# Altium project Diplomski.PrjPcb
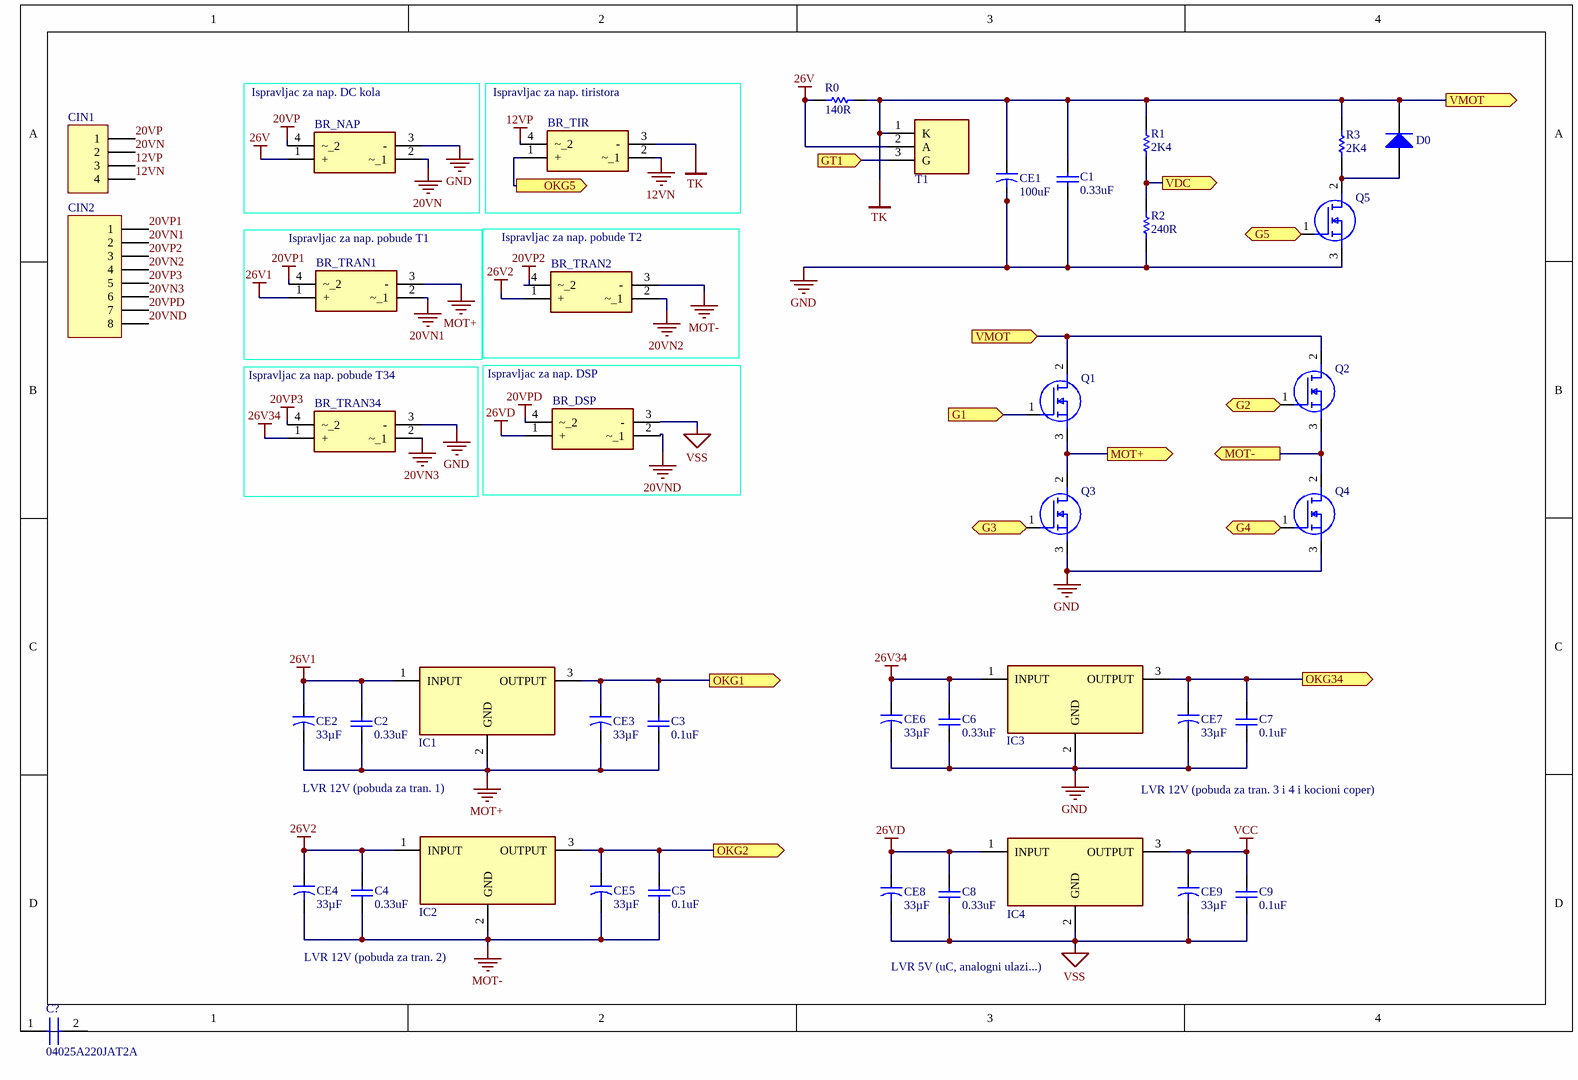
[diagram p0: Napajanje_1.SchDoc]
2 sheets, 120 parts. Net scope: flat (ports and power ports of the same name join across sheets).
Board file: Energetski_deo_ploce.PcbDoc
Sheets:
  Napajanje_1.SchDoc
  Upravljacki deo.SchDoc

## Sheet Napajanje_1.SchDoc
size A4

### Parts
(Parts that share a designator on the sheet are numbered #1, #2 ... from top to bottom, then left to right.)
BR_DSP  W04G-E4/51GI-ND  [BRIGE RECTIFIER]  (value not drawn)
BR_NAP  W04G-E4/51GI-ND  [BRIGE RECTIFIER]  (value not drawn)
BR_TIR  W04G-E4/51GI-ND  [BRIGE RECTIFIER]  (value not drawn)
BR_TRAN1  W04G-E4/51GI-ND  [BRIGE RECTIFIER]  (value not drawn)
BR_TRAN2  W04G-E4/51GI-ND  [BRIGE RECTIFIER]  (value not drawn)
BR_TRAN34  W04G-E4/51GI-ND  [BRIGE RECTIFIER]  (value not drawn)
C1  value 0.33uF  [CAP3, 0.33uF, 50V]  (hidden comment: 1C20Z5U334M050B-ND)  (graphical)
C2  value 0.33uF  [CAP3, 0.33uF, 50V]  (hidden comment: 1C20Z5U334M050B-ND)  (graphical)
C3  value 0.1uF  [CAP4, 0.1uF, 50V]  (hidden comment: BC1160TR-ND)
C4  value 0.33uF  [CAP3, 0.33uF, 50V]  (hidden comment: 1C20Z5U334M050B-ND)  (graphical)
C5  value 0.1uF  [CAP4, 0.1uF, 50V]  (hidden comment: BC1160TR-ND)
C6  value 0.33uF  [CAP3, 0.33uF, 50V]  (hidden comment: 1C20Z5U334M050B-ND)  (graphical)
C7  value 0.1uF  [CAP4, 0.1uF, 50V]  (hidden comment: BC1160TR-ND)
C8  value 0.33uF  [CAP3, 0.33uF, 50V]  (hidden comment: 1C20Z5U334M050B-ND)  (graphical)
C9  value 0.1uF  [CAP4, 0.1uF, 50V]  (hidden comment: BC1160TR-ND)
C?  04025A220JAT2A  [CAPC1005X56N]
CE1  value 100uF  [CAP2 100uF, 35V]  (hidden comment: 399-6104-ND)
CE2  value 33µF  [CAP1 33uF, 35V]  (hidden comment: 399-6575-ND)
CE3  value 33µF  [CAP1 33uF, 35V]  (hidden comment: 399-6575-ND)
CE4  value 33µF  [CAP1 33uF, 35V]  (hidden comment: 399-6575-ND)
CE5  value 33µF  [CAP1 33uF, 35V]  (hidden comment: 399-6575-ND)
CE6  value 33µF  [CAP1 33uF, 35V]  (hidden comment: 399-6575-ND)
CE7  value 33µF  [CAP1 33uF, 35V]  (hidden comment: 399-6575-ND)
CE8  value 33µF  [CAP1 33uF, 35V]  (hidden comment: 399-6575-ND)
CE9  value 33µF  [CAP1 33uF, 35V]  (hidden comment: 399-6575-ND)
CIN1  Header  [HEADER 4 PIN]  (value not drawn)
CIN2  (no value)  [HEADER 8 PIN]
D0  UF4007TR-ND  [DIODE, 1000V, 1A]  (value not drawn)
IC1  512-LM7812ACT  [LM7812ACT, 1A]  (value not drawn)
IC2  512-LM7812ACT  [LM7812ACT, 1A]  (value not drawn)
IC3  512-LM7812ACT  [LM7812ACT, 1A]  (value not drawn)
IC4  LM7805ACT  [LM7805ACT, 1A]  (value not drawn)
Q1#1  STP7NK40ZFP  [MOSFET 400V, 5.4A]  (value not drawn)
Q2  STP7NK40ZFP  [MOSFET 400V, 5.4A]  (value not drawn)
Q3  STP7NK40ZFP  [MOSFET 400V, 5.4A]  (value not drawn)
Q4  STP7NK40ZFP  [MOSFET 400V, 5.4A]  (value not drawn)
Q5  STP7NK40ZFP  [MOSFET 400V, 5.4A]  (value not drawn)
R0  value 140R  [RES5, 140R, 0.25W - duplicate]  (hidden comment: 140XBK-ND)
R1  value 2K4  [RES2, 2K4, 0.25W - duplicate]  (hidden comment: 270QBK-ND)
R2  value 240R  [RES1, 240R, 0.25W]  (hidden comment: 270QBK-ND)
R3  value 2K4  [RES2, 2K4, 0.25W - duplicate]  (hidden comment: 270QBK-ND)
T1  Thyristor1  [THYRISTOR 400V, 8A]  (value not drawn)

### Sub-sheets
Ispravljac za nap. DC kola = ?: no entries
Ispravljac za nap. DSP = ?: no entries
Ispravljac za nap. pobude T1 = ?: no entries
Ispravljac za nap. pobude T2 = ?: no entries
Ispravljac za nap. pobude T34 = ?: no entries
Ispravljac za nap. tiristora = ?: no entries

### Ports
G1 (in), G2 (in), G3 (in), G4 (in), G5 (in), GT1 (in), MOT+ (out), MOT- (out), OKG1 (out), OKG2 (out), OKG5 (out), OKG34 (out), VDC (out), VMOT (in), VMOT (out)

### Nets
12VN: BR_TIR.2(~_1) CIN1.4
12VP: BR_TIR.4(~_2) CIN1.3
20VN: BR_NAP.2(~_1) CIN1.2
20VN1: BR_TRAN1.2(~_1) CIN2.2
20VN2: BR_TRAN2.2(~_1) CIN2.4
20VN3: BR_TRAN34.2(~_1) CIN2.6
20VND: BR_DSP.2(~_1) CIN2.8
20VP: BR_NAP.4(~_2) CIN1.1
20VP1: BR_TRAN1.4(~_2) CIN2.1
20VP2: BR_TRAN2.4(~_2) CIN2.3
20VP3: BR_TRAN34.4(~_2) CIN2.5
20VPD: BR_DSP.4(~_2) CIN2.7
26V: BR_NAP.1(+) R0.2 T1.2(A)
26V1: BR_TRAN1.1(+) C2.2 CE2.1 IC1.1(INPUT)
26V2: BR_TRAN2.1(+) C4.2 CE4.1 IC2.1(INPUT)
26V34: BR_TRAN34.1(+) C6.2 CE6.1 IC3.1(INPUT)
26VD: BR_DSP.1(+) C8.2 CE8.1 IC4.1(INPUT)
GND: BR_NAP.3(-) BR_TRAN34.3(-) C1.1 C6.1 C7.1 CE1.2 CE6.2 CE7.2 IC3.2(GND) Q3.3(S) Q4.3(S) Q5.3(S) R2.1
MOT+: BR_TRAN1.3(-) C2.1 C3.1 CE2.2 CE3.2 IC1.2(GND)
MOT-: BR_TRAN2.3(-) C4.1 C5.1 CE4.2 CE5.2 IC2.2(GND)
TK: BR_TIR.3(-) C1.2 CE1.1 D0.2(K) Q1#1.2(D) Q2.2(D) R0.1 R1.2 R3.2 T1.1(K) ; port VMOT
VCC: C9.2 CE9.1 IC4.3(OUTPUT)
VSS: BR_DSP.3(-) C8.1 C9.1 CE8.2 CE9.2 IC4.2(GND)
NetACS712_3: Q1#1.3(S) Q3.2(D) ; port MOT+
NetBR_TIR_1: BR_TIR.1(+) ; port OKG5
NetC3_2: C3.2 CE3.1 IC1.3(OUTPUT) ; port OKG1
NetC5_2: C5.2 CE5.1 IC2.3(OUTPUT) ; port OKG2
NetC7_2: C7.2 CE7.1 IC3.3(OUTPUT) ; port OKG34
NetC14_1: Q1#1.1(G) ; port G1
NetC15_1: Q2.1(G) ; port G2
NetC16_1: Q3.1(G) ; port G3
NetC17_1: Q4.1(G) ; port G4
NetC19_1: Q5.1(G) ; port G5
NetC21_2: T1.3(G) ; port GT1
NetD0_1: D0.1(A) Q5.2(D) R3.1
NetIC12_5: R1.1 R2.2 ; port VDC
NetP3_1: Q2.3(S) Q4.2(D) ; port MOT-

Not connected (* = marked no-connect by the designer): C? 1 2

### Notes on the sheet
- LVR 12V (pobuda za tran. 1)
- LVR 12V (pobuda za tran. 3 i 4 i kocioni coper)
- LVR 12V (pobuda za tran. 2)
- LVR 5V (uC, analogni ulazi...)

### Library data of the parts
BR_DSP BR_NAP BR_TIR BR_TRAN1 BR_TRAN2 BR_TRAN34 = Bridge rectifier: 1 Phase, 400V, 1.5A; Detailed Description: Bridge Rectifier Single Phase Standard 400V Through Hole WOG; Datasheet link: http://www.vishay.com/docs/88769/woo5g.pdf; Digi-Key Part Number: W04G-E4/51GI-ND; Manufacturer Part Number: W04G-E4/51
C1 C2 C4 C6 C8 = Cap3: CER 0.33uF, 50V; Manufacturer: Vishay BC Components; Digi-Key Part Number: 1C20Z5U334M050B-ND; Datasheet Link: https://media.digikey.com/pdf/Data%20Sheets/BC%20Components%20PDFs/1C-9C_Series_Rev_Sep_2015.pdf; Manufacturer Part Number: 1C20Z5U334M050B
C3 C5 C7 C9 = Cap4: CER 0.1uF, 50V; Manufacturer: Vishay BC Components; Manufacturer Part Number: K104Z15Y5VF5TL2; Detailed Description: 0.1µF -20%, +80% 50V Ceramic Capacitor Y5V (F) Radial; Digi-Key Part Number: BC1160TR-ND; Datasheet: http://www.vishay.com/docs/45171/kseries.pdf
C? = 04025A220JAT2A: Capacitor; Manufacturer_Name: AVX; Datasheet Link: http://www.mouser.com/catalog/supplier/library/pdf/AVXSurfaceMountCeramic.pdf; Height: 0.56mm; Manufacturer_Part_Number: 04025A220JAT2A; Arrow Part Number: 04025A220JAT2A; Arrow Price/Stock: https://www.arrow.com/en/products/04025a220jat2a/avx; Mouser Part Number: 581-04025A220J; Mouser Price/Stock: https://www.mouser.com/Search/Refine.aspx?Keyword=581-04025A220J
CE1 = Cap2: ALU 100uF, 35V; Manufacturer: KEMET; Manufacturer Part Number: ESK107M035AE3AA; Digi-Key Part Number: 399-6104-ND; Datasheet link: https://api.kemet.com/component-edge/download/specsheet/ESK107M035AE3AA.pdf
CE2-CE9 = Cap1: ALU 33uF, 35V; Manufacturer: KEMET; Manufacturer Part Number: ESH336M035AC3AA; Detailed Description: 33µF 35V Aluminum Electrolytic Capacitors Radial, Can  2000 Hrs @ 105°C; Digi-Key Part Number: 399-6575-ND; Datasheet: https://content.kemet.com/datasheets/KEM_A4005_ESH.pdf
CIN1 = Header 4: Header, 4-Pin; Manufacturer: TE Connectivity AMP Connectors; Manufacturer Part Number: 3-282836-2; Detailed Description: 4 Position Wire to Board Terminal Block Horizontal with Board 0.197" (5.00mm) Through Hole; Digi-Key Part Number: A136029-ND; Datasheet link: https://www.te.com/commerce/DocumentDelivery/DDEController?Action=srchrtrv&DocNm=282836&DocType=Customer+Drawing&DocLang=English
CIN2 = Connector 8: Header, 8-Pin; Manufacturer: Phoenix Contact; Manufacturer Part Number: 1727078; Detailed Description: 8 Position Wire to Board Terminal Block Horizontal with Board 0.150" (3.81mm) Through Hole; Digi-Key Part Number: 277-1953-ND; Datasheet link: https://media.digikey.com/pdf/Data%20Sheets/Phoenix%20Contact%20PDFs/1727078.pdf
D0 = Diode: DIODE GEN PURP 1KV 1A DO41; Manufacturer: ON Semiconductor; Manufacturer Part Number: UF4007; Detailed Description: Diode Standard 1000V 1A Through Hole DO-204AL (DO-41); Digi-Key Part Number: UF4007TR-ND; Datasheet link: https://www.onsemi.com/pub/Collateral/UF4007-D.pdf
IC1-IC3 = IC2: LM7812ACT, 1A; Manufacturer_Name: ON Semiconductor; Datasheet Link: https://componentsearchengine.com/Datasheets/2/LM7805ACT.pdf; Manufacturer_Part_Number: LM7812ACT; Mouser Part Number: 512-LM7812ACT; Mouser Price/Stock: https://www.mouser.com/Search/Refine.aspx?Keyword=512-LM7805ACT; RS Part Number: 8062839; RS Price/Stock: http://uk.rs-online.com/web/p/products/8062839
IC4 = IC1: LM7805ACT, 1A; Manufacturer_Name: ON Semiconductor; Datasheet Link: https://componentsearchengine.com/Datasheets/2/LM7805ACT.pdf; Height: 4.7mm; Manufacturer_Part_Number: LM7805ACT; Mouser Part Number: 512-LM7805ACT; Mouser Price/Stock: https://www.mouser.com/Search/Refine.aspx?Keyword=512-LM7805ACT; RS Part Number: 8062839; RS Price/Stock: http://uk.rs-online.com/web/p/products/8062839
Q1#1 Q2-Q5 = MOSFET: MOSFET (N-Channel); Manufacturer_Name: STMicroelectronics; Allied_Number: 70547873; Datasheet Link: http://www.st.com/web/en/resource/technical/document/datasheet/CD00003040.pdf; Height: 4.6mm; Manufacturer_Part_Number: STP7NK40ZFP; Mouser Part Number: 511-STP7NK40ZFP; Mouser Price/Stock: https://www.mouser.com/Search/Refine.aspx?Keyword=511-STP7NK40ZFP; RS Part Number: 8107418; RS Price/Stock: https://uk.rs-online.com/web/p/products/8107418; Allied Price/Stock: http://www.alliedelec.com/stmicroelectronics-stp7nk40zfp/70547873/
R0 = Res5: 140 Ohm, 0.25W; Manufacturer: Yageo; Manufacturer Part Number: MFR-25FBF52-140R; Detailed Description: 1 kOhms ±5% 0.25W, 1/4W Through Hole Resistor Axial  Carbon Film; Digi-Key Part Number: 140XBK-ND; Datasheet link: https://www.yageo.com/upload/media/product/products/datasheet/lr/Yageo_LR_CFR_1.pdf
R1 R3 = Res2: 2K4, 0.25W
R2 = Res1: 240 Ohm, 0.25W; Manufacturer: Yageo; Manufacturer Part Number: CFR-25JB-52-270R; Detailed Description: 240 Ohms ±5% 0.25W, 1/4W Through Hole Resistor Axial  Carbon Film; Digi-Key Part Number: 270QBK-ND; Datasheet link: https://www.yageo.com/upload/media/product/products/datasheet/lr/Yageo_LR_CFR_1.pdf
T1 = Thyristor1: SCR, 400V, 8A; Manufacturer: STMicroelectronics; Manufacturer Part Number: TXN408GRG; Detailed Description: SCR 400V 8A Standard Recovery Through Hole TO-220AB; Digi-Key Part Number: 497-4480-5-ND; Datasheets: https://media.digikey.com/pdf/Data%20Sheets/ST%20Microelectronics%20PDFS/TXN,TYN%20058-1008%20G.pdf

## Sheet Upravljacki deo.SchDoc
size A3
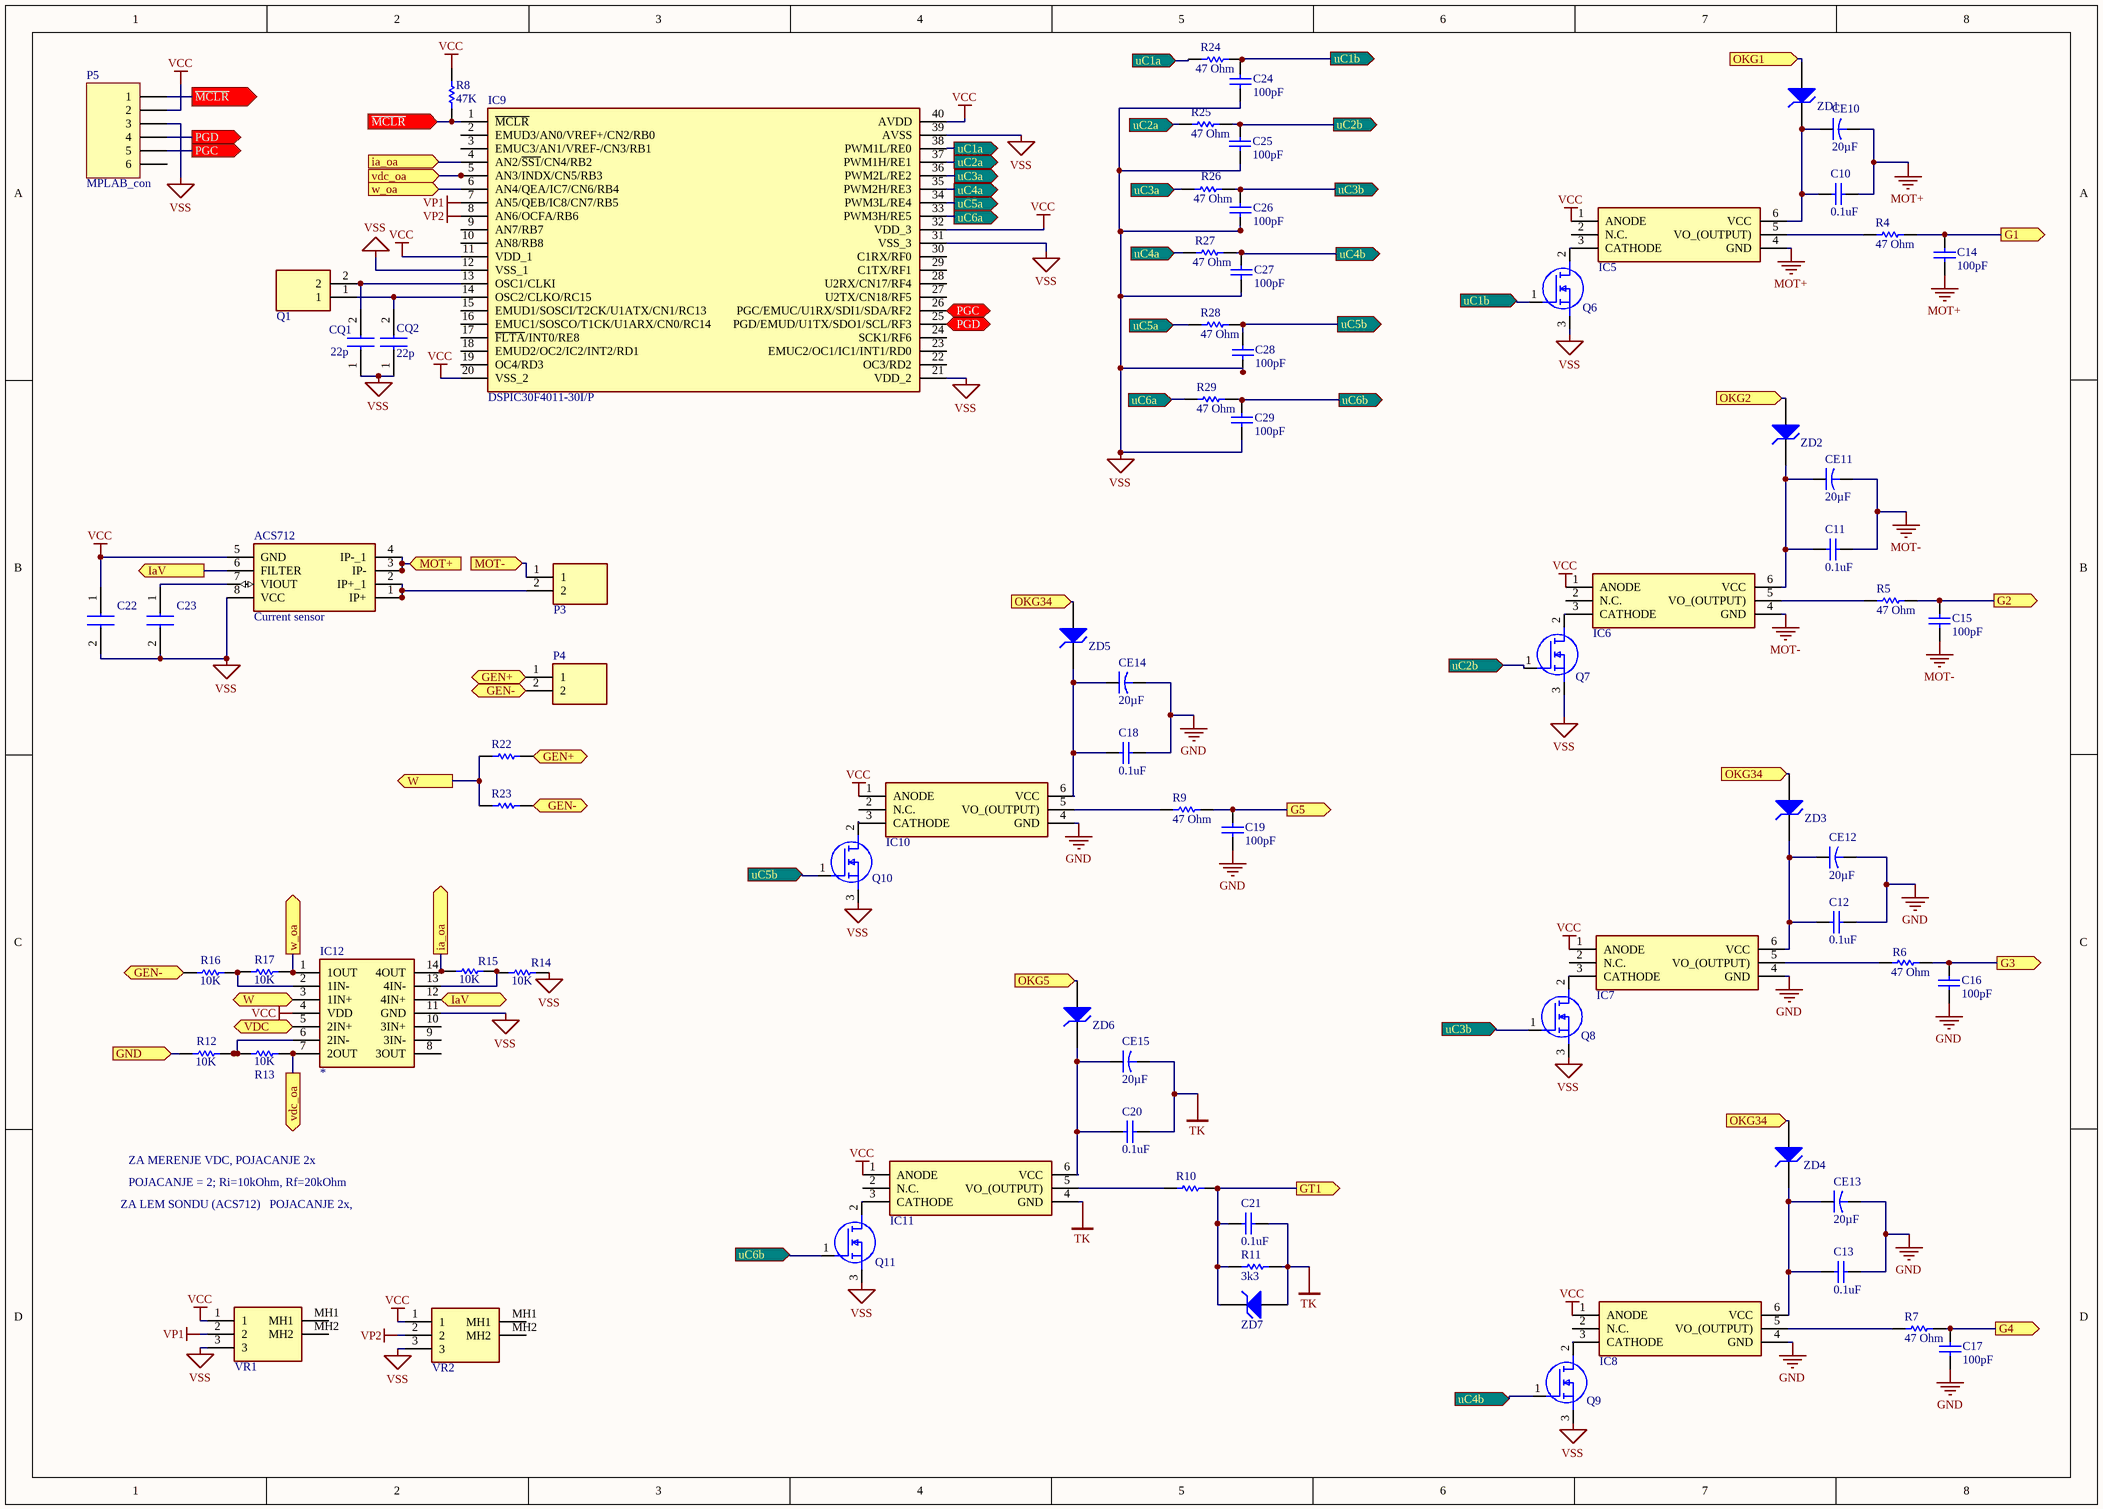
[diagram p1: Upravljacki deo.SchDoc]

### Parts
(Parts that share a designator on the sheet are numbered #1, #2 ... from top to bottom, then left to right.)
ACS712  Current sensor  [SOIC127P600X175-8N]
C10  value 0.1uF  [CAP4, 0.1uF, 50V]  (hidden comment: BC1160TR-ND)
C11  value 0.1uF  [CAP4, 0.1uF, 50V]  (hidden comment: BC1160TR-ND)
C12  value 0.1uF  [CAP4, 0.1uF, 50V]  (hidden comment: BC1160TR-ND)
C13  value 0.1uF  [CAP4, 0.1uF, 50V]  (hidden comment: BC1160TR-ND)
C14  value 100pF  [CAP6, 100pF, 50V]  (hidden comment: BC5223TB-ND)
C15  value 100pF  [CAP6, 100pF, 50V]  (hidden comment: BC5223TB-ND)
C16  value 100pF  [CAP6, 100pF, 50V]  (hidden comment: BC5223TB-ND)
C17  value 100pF  [CAP6, 100pF, 50V]  (hidden comment: BC5223TB-ND)
C18  value 0.1uF  [CAP4, 0.1uF, 50V]  (hidden comment: BC1160TR-ND)
C19  value 100pF  [CAP6, 100pF, 50V]  (hidden comment: BC5223TB-ND)
C20  value 0.1uF  [CAP4, 0.1uF, 50V]  (hidden comment: BC1160TR-ND)
C21  value 0.1uF  [CAP4, 0.1uF, 50V]  (hidden comment: BC1160TR-ND)
C22  C0805C104K9RACTU  [CAP10, 0.1uF, 6.4V]  (value not drawn)
C23  C1206Y102K9RAC7800  [CAP9, 1000pF, 6.3V]  (value not drawn)
C24  value 100pF  [CAP6, 100pF, 50V]  (hidden comment: BC5223TB-ND)
C25  value 100pF  [CAP6, 100pF, 50V]  (hidden comment: BC5223TB-ND)
C26  value 100pF  [CAP6, 100pF, 50V]  (hidden comment: BC5223TB-ND)
C27  value 100pF  [CAP6, 100pF, 50V]  (hidden comment: BC5223TB-ND)
C28  value 100pF  [CAP6, 100pF, 50V]  (hidden comment: BC5223TB-ND)
C29  value 100pF  [CAP6, 100pF, 50V]  (hidden comment: BC5223TB-ND)
CE10  value 20µF  [CAP8, 20uF, 16V]  (hidden comment: TE1157-E3-ND)
CE11  value 20µF  [CAP8, 20uF, 16V]  (hidden comment: TE1157-E3-ND)
CE12  value 20µF  [CAP8, 20uF, 16V]  (hidden comment: TE1157-E3-ND)
CE13  value 20µF  [CAP8, 20uF, 16V]  (hidden comment: TE1157-E3-ND)
CE14  value 20µF  [CAP8, 20uF, 16V]  (hidden comment: TE1157-E3-ND)
CE15  value 20µF  [CAP8, 20uF, 16V]  (hidden comment: TE1157-E3-ND)
CQ1  22p  [CAPC1005X56N]
CQ2  22p  [CAPC1005X56N]
IC5  TLP701H(TP,F)  [OPTOISO, 30V, 60mA]  (value not drawn)
IC6  TLP701H(TP,F)  [OPTOISO, 30V, 60mA]  (value not drawn)
IC7  TLP701H(TP,F)  [OPTOISO, 30V, 60mA]  (value not drawn)
IC8  TLP701H(TP,F)  [OPTOISO, 30V, 60mA]  (value not drawn)
IC9  DSPIC30F4011-30I/P  [DIP1543W58P254L5175H635Q40N]
IC10  TLP701H(TP,F)  [OPTOISO, 30V, 60mA]  (value not drawn)
IC11  TLP701H(TP,F)  [OPTOISO, 30V, 60mA]  (value not drawn)
IC12  *  [4xOPAMP_DIP254P762X508-14]
P3  Connector 2  [SHDR2W100P0X500_1X2_1000X820X1020P]  (value not drawn)
P4  Connector 2  [SHDR2W100P0X500_1X2_1000X820X1020P]  (value not drawn)
P5  MPLAB_con  [MPLAB CONNECTOR]
Q1#2  *  [HC-49-4H]  (value not drawn)
Q6  STP7NK40ZFP  [MOSFET 400V, 5.4A]  (value not drawn)
Q7  STP7NK40ZFP  [MOSFET 400V, 5.4A]  (value not drawn)
Q8  STP7NK40ZFP  [MOSFET 400V, 5.4A]  (value not drawn)
Q9  STP7NK40ZFP  [MOSFET 400V, 5.4A]  (value not drawn)
Q10  STP7NK40ZFP  [MOSFET 400V, 5.4A]  (value not drawn)
Q11  STP7NK40ZFP  [MOSFET 400V, 5.4A]  (value not drawn)
R4  value 47 Ohm  [RES3, 47R, 0.25W - duplicate]  (hidden comment: 47QBK-ND)
R5  value 47 Ohm  [RES3, 47R, 0.25W - duplicate]  (hidden comment: 47QBK-ND)
R6  value 47 Ohm  [RES3, 47R, 0.25W - duplicate]  (hidden comment: 47QBK-ND)
R7  value 47 Ohm  [RES3, 47R, 0.25W - duplicate]  (hidden comment: 47QBK-ND)
R8  value 47K  [RES3, 47R, 0.25W - duplicate]  (hidden comment: 47KQTR-ND)
R9  value 47 Ohm  [RES3, 47R, 0.25W - duplicate]  (hidden comment: 47QBK-ND)
R10  470QTR-ND  [RES3, 47R, 0.25W - duplicate]  (value not drawn)
R11  value 3k3  [RES6, 3K3, 0.25W - duplicate]  (hidden comment: CFR-25JR-52-3K3)
R12  CFR-25JR-52-10K  [RES4, 10K, 0.25W - duplicate]  (value not drawn)
R13  CFR-25JR-52-10K  [RES4, 10K, 0.25W - duplicate]  (value not drawn)
R14  CFR-25JR-52-10K  [RES4, 10K, 0.25W - duplicate]  (value not drawn)
R15  CFR-25JR-52-10K  [RES4, 10K, 0.25W - duplicate]  (value not drawn)
R16  CFR-25JR-52-10K  [RES4, 10K, 0.25W - duplicate]  (value not drawn)
R17  CFR-25JR-52-10K  [RES4, 10K, 0.25W - duplicate]  (value not drawn)
R22  24KQBK-ND  [RES2, 2K4, 0.25W - duplicate]  (value not drawn)
R23  2.4KQBK-ND  [RES1, 240R, 0.25W]  (value not drawn)
R24  value 47 Ohm  [RES3, 47R, 0.25W - duplicate]  (hidden comment: 47QBK-ND)
R25  value 47 Ohm  [RES3, 47R, 0.25W - duplicate]  (hidden comment: 47QBK-ND)
R26  value 47 Ohm  [RES3, 47R, 0.25W - duplicate]  (hidden comment: 47QBK-ND)
R27  value 47 Ohm  [RES3, 47R, 0.25W - duplicate]  (hidden comment: 47QBK-ND)
R28  value 47 Ohm  [RES3, 47R, 0.25W - duplicate]  (hidden comment: 47QBK-ND)
R29  value 47 Ohm  [RES3, 47R, 0.25W - duplicate]  (hidden comment: 47QBK-ND)
VR1  PTV09A-1220F-B103  [PTV09A1220FB103]  (value not drawn)
VR2  PTV09A-1220F-B103  [PTV09A1220FB103]  (value not drawn)
ZD1  BZX55C12-TAPGICT-ND  [ZENER DIODE, 12V, 200mA, 500mW]  (value not drawn)
ZD2  BZX55C12-TAPGICT-ND  [ZENER DIODE, 12V, 200mA, 500mW]  (value not drawn)
ZD3  BZX55C12-TAPGICT-ND  [ZENER DIODE, 12V, 200mA, 500mW]  (value not drawn)
ZD4  BZX55C12-TAPGICT-ND  [ZENER DIODE, 12V, 200mA, 500mW]  (value not drawn)
ZD5  BZX55C12-TAPGICT-ND  [ZENER DIODE, 12V, 200mA, 500mW]  (value not drawn)
ZD6  BZX55C12-TAPGICT-ND  [ZENER DIODE, 12V, 200mA, 500mW]  (value not drawn)
ZD7  BZX55C12-TAPGICT-ND  [ZENER DIODE, 12V, 200mA, 500mW]  (value not drawn)

### Ports
G1 (out), G2 (out), G3 (out), G4 (out), G5 (out), GEN+ (in), GEN+ (out), GEN- (in), GEN- (out), GND (in), GT1 (out), ia_oa (in), ia_oa (out), IaV (in), IaV (out), MOT+ (in), MOT- (in), OKG1 (in), OKG2 (in), OKG5 (in), OKG34 (in), PGC (in), PGC (out), PGD (in), PGD (out), uC1a (in), uC1a (out), uC1b (in), uC1b (out), uC2a (in), uC2a (out), uC2b (in), uC2b (out), uC3a (in), uC3a (out), uC3b (in), uC3b (out), uC4a (in), uC4a (out), uC4b (in), uC4b (out), uC5a (in), uC5a (out), uC5b (in), uC5b (out), uC6a (in), uC6a (out), uC6b (in), uC6b (out), VDC (in), vdc_oa (in), vdc_oa (out), W (in), W (out), w_oa (in), w_oa (out), ~{MCLR} (in), ~{MCLR} (out)

### Nets
GND: C12.1 C13.1 C16.2 C17.2 C18.1 C19.2 CE12.2 CE13.2 CE14.2 IC7.4(GND) IC8.4(GND) IC10.4(GND)
MOT+: C10.1 C14.2 CE10.2 IC5.4(GND)
MOT-: C11.1 C15.2 CE11.2 IC6.4(GND)
TK: C20.1 C21.1 CE15.2 IC11.4(GND) R11.1 ZD7.1(A)
VCC: ACS712.5(GND) C22.1 IC5.1(ANODE) IC6.1(ANODE) IC7.1(ANODE) IC8.1(ANODE) IC9.11(VDD_1) IC9.20(VSS_2) IC9.32(VDD_3) IC9.40(AVDD) IC10.1(ANODE) IC11.1(ANODE) IC12.4(VDD) P5.2 R8.2 VR1.1 VR2.1
VP1: IC9.7(AN5/QEB/IC8/CN7/RB5) VR1.2
VP2: IC9.8(AN6/OCFA/RB6) VR2.2
VSS: ACS712.8(VCC) C22.2 C23.2 C24.2 C25.2 C26.2 C27.2 C28.2 C29.2 CQ1.1 CQ2.1 IC9.12(VSS_1) IC9.21(VDD_2) IC9.31(VSS_3) IC9.39(AVSS) IC12.11(GND) P5.3 Q6.3(S) Q7.3(S) Q8.3(S) Q9.3(S) Q10.3(S) Q11.3(S) R14.1 VR1.3 VR2.3
NetACS712_1: ACS712.1(IP+) ACS712.2(IP+_1) P3.2
NetACS712_3: ACS712.3(IP-) ACS712.4(IP-_1) ; port MOT+
NetACS712_6: ACS712.6(FILTER) IC12.12(4IN+) ; port IaV
NetACS712_7: ACS712.7(VIOUT) C23.1
NetBR_TIR_1: ZD6.1(A) ; port OKG5
NetC3_2: ZD1.1(A) ; port OKG1
NetC5_2: ZD2.1(A) ; port OKG2
NetC7_2: ZD3.1(A) ZD4.1(A) ZD5.1(A) ; port OKG34
NetC10_2: C10.2 CE10.1 IC5.6(VCC) ZD1.2(K)
NetC11_2: C11.2 CE11.1 IC6.6(VCC) ZD2.2(K)
NetC12_2: C12.2 CE12.1 IC7.6(VCC) ZD3.2(K)
NetC13_2: C13.2 CE13.1 IC8.6(VCC) ZD4.2(K)
NetC14_1: C14.1 R4.1 ; port G1
NetC15_1: C15.1 R5.1 ; port G2
NetC16_1: C16.1 R6.1 ; port G3
NetC17_1: C17.1 R7.1 ; port G4
NetC18_2: C18.2 CE14.1 IC10.6(VCC) ZD5.2(K)
NetC19_1: C19.1 R9.1 ; port G5
NetC20_2: C20.2 CE15.1 IC11.6(VCC) ZD6.2(K)
NetC21_2: C21.2 R10.1 R11.2 ZD7.2(K) ; port GT1
NetC24_1: C24.1 Q6.1(G) R24.1 ; port uC1b
NetC25_1: C25.1 Q7.1(G) R25.1 ; port uC2b
NetC26_1: C26.1 Q8.1(G) R26.1 ; port uC3b
NetC27_1: C27.1 Q9.1(G) R27.1 ; port uC4b
NetC28_1: C28.1 Q10.1(G) R28.1 ; port uC5b
NetC29_1: C29.1 Q11.1(G) R29.1 ; port uC6b
NetCQ1_2: CQ1.2 IC9.13(OSC1/CLKI) Q1#2.2
NetCQ2_2: CQ2.2 IC9.14(OSC2/CLKO/RC15) Q1#2.1
NetIC5_3: IC5.3(CATHODE) Q6.2(D)
NetIC5_5: IC5.5(VO_(OUTPUT)) R4.2
NetIC6_3: IC6.3(CATHODE) Q7.2(D)
NetIC6_5: IC6.5(VO_(OUTPUT)) R5.2
NetIC7_3: IC7.3(CATHODE) Q8.2(D)
NetIC7_5: IC7.5(VO_(OUTPUT)) R6.2
NetIC8_3: IC8.3(CATHODE) Q9.2(D)
NetIC8_5: IC8.5(VO_(OUTPUT)) R7.2
NetIC9_1: IC9.1(~{MCLR}) P5.1 R8.1 ; port ~{MCLR}
NetIC9_4: IC9.4(AN2/~{SS1}/CN4/RB2) IC12.14(4OUT) R15.2 ; port ia_oa
NetIC9_5: IC9.5(AN3/INDX/CN5/RB3) IC12.7(2OUT) R13.1 ; port vdc_oa
NetIC9_6: IC9.6(AN4/QEA/IC7/CN6/RB4) IC12.1(1OUT) R17.1 ; port w_oa
NetIC9_25: IC9.25(PGD/EMUD/U1TX/SDO1/SCL/RF3) P5.4 ; port PGD
NetIC9_26: IC9.26(PGC/EMUC/U1RX/SDI1/SDA/RF2) P5.5 ; port PGC
NetIC9_33: IC9.33(PWM3H/RE5) R29.2 ; port uC6a
NetIC9_34: IC9.34(PWM3L/RE4) R28.2 ; port uC5a
NetIC9_35: IC9.35(PWM2H/RE3) R27.2 ; port uC4a
NetIC9_36: IC9.36(PWM2L/RE2) R26.2 ; port uC3a
NetIC9_37: IC9.37(PWM1H/RE1) R25.2 ; port uC2a
NetIC9_38: IC9.38(PWM1L/RE0) R24.2 ; port uC1a
NetIC10_3: IC10.3(CATHODE) Q10.2(D)
NetIC10_5: IC10.5(VO_(OUTPUT)) R9.2
NetIC11_3: IC11.3(CATHODE) Q11.2(D)
NetIC11_5: IC11.5(VO_(OUTPUT)) R10.2
NetIC12_2: IC12.2(1IN-) R16.1 R17.2
NetIC12_3: IC12.3(1IN+) R22.2 R23.2 ; port W
NetIC12_5: IC12.5(2IN+) ; port VDC
NetIC12_6: IC12.6(2IN-) R12.1 R13.2
NetIC12_13: IC12.13(4IN-) R14.2 R15.1
NetP3_1: P3.1 ; port MOT-
NetP4_1: P4.1 R22.1 ; port GEN+
NetP4_2: P4.2 R16.2 R23.1 ; port GEN-
NetR12_2: R12.2 ; port GND

Not connected (* = marked no-connect by the designer): IC5 2(N.C.); IC6 2(N.C.); IC7 2(N.C.); IC8 2(N.C.); IC9 2(EMUD3/AN0/VREF+/CN2/RB0) 3(EMUC3/AN1/VREF-/CN3/RB1) 9(AN7/RB7) 10(AN8/RB8) 15(EMUD1/SOSCI/T2CK/U1ATX/CN1/RC13) 16(EMUC1/SOSCO/T1CK/U1ARX/CN0/RC14) 17(~{FLTA}/INT0/RE8) 18(EMUD2/OC2/IC2/INT2/RD1) 19(OC4/RD3) 22(OC3/RD2) 23(EMUC2/OC1/IC1/INT1/RD0) 24(SCK1/RF6) 27(U2TX/CN18/RF5) 28(U2RX/CN17/RF4) 29(C1TX/RF1) 30(C1RX/RF0); IC10 2(N.C.); IC11 2(N.C.); IC12 8(3OUT) 9(3IN-) 10(3IN+); P5 6; VR1 MH1 MH2; VR2 MH1 MH2

### Notes on the sheet
- POJACANJE = 2; Ri=10kOhm, Rf=20kOhm
- ZA MERENJE VDC, POJACANJE 2x
- ZA LEM SONDU (ACS712)   POJACANJE 2x,
- (in symbol Res4) 10K

### Library data of the parts
ACS712 = Current sensor: ACS712ELCTR-05B-T; Manufacturer_Name: Allegro Microsystems; Allied_Number: R1076681; Datasheet Link: http://docs-emea.rs-online.com/webdocs/0d88/0900766b80d885f5.pdf; Height: 1.75mm; Manufacturer_Part_Number: ACS712ELCTR-05B-T; RS Part Number: 6807131P; RS Price/Stock: http://uk.rs-online.com/web/p/products/6807131P; Allied Price/Stock: http://www.alliedelec.com/allegro-microsystems-acs712elctr-05b-t/R1076681/
C10-C13 C18 C20 C21 = Cap4: as C3 on sheet Napajanje_1; Digi-Key Part Number: BC1160TR-ND; Datasheet: http://www.vishay.com/docs/45171/kseries.pdf
C14-C17 C19 C24-C29 = Cap6: CER, 100pF, 50V; Manufacturer: Vishay BC Components; Manufacturer Part Number: K101J10C0GF5UH5; Detailed Description: 100pF ±5% 50V Ceramic Capacitor C0G, NP0 Radial; Digi-Key Part Number: BC5223TB-ND; Datasheets: http://www.vishay.com/docs/45171/kseries.pdf
C22 = Cap10: CER 0.1uF, 6.3V; Manufacturer_Name: Kemet; Datasheet Link: https://content.kemet.com/datasheets/KEM_C1002_X7R_SMD.pdf; Height: 0.88mm; Manufacturer_Part_Number: C0805C104K9RACTU; Arrow Part Number: C0805C104K9RACTU; Arrow Price/Stock: https://www.arrow.com/en/products/c0805c104k9ractu/kemet-corporation; Mouser Part Number: 80-C0805C104K9R; Mouser Price/Stock: https://www.mouser.co.uk/ProductDetail/KEMET/C0805C104K9RACTU?qs=jbCUrP3sAgRYLjBU7s5h8Q%3D%3D
C23 = Cap9: CER 1000pF, 6.3V; Manufacturer_Name: Kemet; Manufacturer_Part_Number: C1206Y102K9RACTU; Detailed description: Multilayer Ceramic Capacitors MLCC - SMD/SMT 6.3V 1000pF X7R 1206 10%; Datasheet Link: https://content.kemet.com/datasheets/KEM_C1015_X7R_FF-CAP_SMD.pdf; Mouser Part Number: 80-C1206Y102K9R
CE10-CE15 = Cap8: ALU 20uF, 16V; Manufacturer: Vishay Sprague; Detailed Description: 20µF 16V Aluminum Electrolytic Capacitors Axial, Can  2000 Hrs @ 85°C; Digi-Key Part Number: TE1157-E3-ND; Manufacturer Part Number: TE1157-E3; Datasheet: http://www.vishay.com/docs/42042/te.pdf
CQ1 CQ2 = Cap 0402 22p: Capacitor; Manufacturer: Yageo; Manufacturer code: CC0402KRNPO9BN220; Datasheet: https://www.yageo.com/upload/media/product/productsearch/datasheet/mlcc/UPY-GP_NP0_16V-to-50V_18.pdf; Distributor code: 311-3781-1-ND; Distributor: Digi-key
IC5-IC8 IC10 IC11 = IC3: OPTOISO, 600mA, 10V ~ 30V; Manufacturer: Toshiba Semiconductor and Storage; Detailed Description: Logic Output Optoisolator  Push-Pull, Totem Pole 5000Vrms 1 Channel 20kV/µs CMTI 6-SO; Datasheet Link: https://eu.mouser.com/datasheet/2/408/TLP701H_datasheet_en_20151223-1135480.pdf; Manufacturer Part Number: TLP701H(TP,F)
IC9 = IC4: Manufacturer_Name: Microchip; Allied_Number: 70045352; Datasheet Link: https://componentsearchengine.com/Datasheets/5/DSPIC30F4011-30I_P.pdf; Height: 6.35mm; Manufacturer_Part_Number: DSPIC30F4011-30I/P; Mouser Part Number: 579-30F4011-30I/P; Mouser Price/Stock: https://www.mouser.com/Search/Refine.aspx?Keyword=579-30F4011-30I%2FP; RS Part Number: 6229954P; RS Price/Stock: http://uk.rs-online.com/web/p/products/6229954P; Allied Price/Stock: https://www.alliedelec.com/microchiptechnologyinc-dspic30f4011-30i-p/70045352/
IC12 = TLC27M4AIN: Integrated Circuit; Manufacturer_Name: Texas Instruments; Datasheet Link: http://www.ti.com/lit/gpn/tlc27m4a; Manufacturer_Part_Number: TLC27M4AIN; Arrow Part Number: TLC27M4AIN; Mouser Part Number: 595-TLC27M4AIN; Mouser Price/Stock: https://www.mouser.com/Search/Refine.aspx?Keyword=595-TLC27M4AIN
P3 P4 = Connector 2: Connector, 2 pin; Manufacturer: TE Connectivity AMP Connectors; Manufacturer Part Number: 282836-2; Detailed Description: 2 Position Wire to Board Terminal Block Horizontal with Board 0.197" (5.00mm) Through Hole; Digi-Key Part Number: A98076-ND; Datasheet link: https://www.te.com/commerce/DocumentDelivery/DDEController?Action=srchrtrv&DocNm=1308389_EUROSTYLE_TERMINAL_BLOCKS&DocType=CS&DocLang=English
P5 = Header 6: MPLAB connector; Manufacturer: TE Connectivity AMP Connectors; Manufacturer Part Number: 5555165-1; Detailed Description: Jack Modular Connector 6p6c (RJ11, RJ12, RJ14, RJ25) 90° Angle (Right) Unshielded Cat3; Digi-Key Part Number: A31422-ND; Datasheets: https://www.te.com/commerce/DocumentDelivery/DDEController?Action=srchrtrv&DocNm=5555165&DocType=Customer+Drawing&DocLang=English
Q1#2 = Crystal oscillator: CRYSTAL 7.3728MHZ 18PF T/H; Manufacturer: ECS Inc.; Manufacturer code: ECS-73-18-4XEN; Datasheet: https://ecsxtal.com/store/pdf/hc-49usx.pdf; Distributor code: XC1740-ND; Distributor: Digi-Key
Q6-Q11 = MOSFET: as Q1#1 on sheet Napajanje_1; Datasheet Link: http://www.st.com/web/en/resource/technical/document/datasheet/CD00003040.pdf; Height: 4.6mm; Manufacturer_Part_Number: STP7NK40ZFP; Mouser Part Number: 511-STP7NK40ZFP; Mouser Price/Stock: https://www.mouser.com/Search/Refine.aspx?Keyword=511-STP7NK40ZFP; RS Part Number: 8107418; RS Price/Stock: https://uk.rs-online.com/web/p/products/8107418; Allied Price/Stock: http://www.alliedelec.com/stmicroelectronics-stp7nk40zfp/70547873/
R4-R7 R9 R24-R29 = Res3: 47 Ohm, 0.25W; Manufacturer: Yageo; Manufacturer Part Number: CFR-25JB-52-47R; Detailed Description: 47 Ohms ±5% 0.25W, 1/4W Through Hole Resistor Axial  Carbon Film; Digi-Key Part Number: 47QBK-ND; Datasheet link: https://www.yageo.com/upload/media/product/products/datasheet/lr/Yageo_LR_CFR_1.pdf
R8 = Res7: 47 KOhm, 0.25W; Manufacturer: Yageo; Manufacturer Part Number: CFR-25JR-52-47K; Detailed Description: 47 kOhms ±5% 0.25W, 1/4W Through Hole Resistor Axial  Carbon Film; Digi-Key Part Number: 47KQTR-ND; Datasheet link: https://www.yageo.com/upload/media/product/products/datasheet/lr/Yageo_LR_CFR_1.pdf
R10 = Res3: RES 470 OHM 1/4W 5% AXIAL; Manufacturer: Yageo; Manufacturer Part Number: CFR-25JR-52-470R; Detailed Description: 470 Ohms ±5% 0.25W, 1/4W Through Hole Resistor Axial Carbon Film; Digi-Key Part Number: 470QTR-ND; Datasheet link: https://www.yageo.com/upload/media/product/products/datasheet/lr/Yageo_LR_CFR_1.pdf
R11 = Res6: 3K3 Ohm, 0.25W; Manufacturer: Yageo; Detailed Description: 3.3 kOhms ±5% 0.25W, 1/4W Through Hole Resistor Axial  Carbon Film; Digi-Key Part Number: 13-CFR-25JR-52-3K3CT-ND; Manufacturer Part Number: CFR-25JR-52-3K3
R12-R17 = Res4: 10K, 0,25W; Manufacturer_Name: YAGEO (PHYCOMP); Datasheet Link: https://componentsearchengine.com/Datasheets/1/CFR-25JR-52-10K.pdf; Manufacturer_Part_Number: CFR-25JR-52-10K; Arrow Part Number: CFR-25JR-52-10K; Arrow Price/Stock: https://www.arrow.com/en/products/cfr-25jr-52-10k/yageo; Mouser Part Number: 603-CFR-25JR-5210K; Mouser Price/Stock: https://www.mouser.com/Search/Refine.aspx?Keyword=603-CFR-25JR-5210K
R22 = Res2: RES 24K OHM 1/4W 5% AXIAL; Manufacturer Part Number: Number  CFR-25JB-52-24K; Manufacturer: Yageo; Digi-Key Part Number: 24KQBK-ND; Datasheets: https://www.yageo.com/upload/media/product/products/datasheet/lr/Yageo_LR_CFR_1.pdf
R23 = Res1: RES 2.4K OHM 1/4W 5% AXIAL; Manufacturer: Yageo; Manufacturer Part Number: CFR-25JB-52-2K4; Detailed Description: 2.4 kOhms ±5% 0.25W, 1/4W Through Hole Resistor Axial Carbon Film; Digi-Key Part Number: 2.4KQBK-ND; Datasheet link: https://www.yageo.com/upload/media/product/products/datasheet/lr/Yageo_LR_CFR_1.pdf
VR1 VR2 = PTV09A-1220F-B103: Variable Resistor; Manufacturer: CTS Electrocomponents; Manufacturer Code: 296UD103B1N; Ordering Code: CT2265-ND; Datasheet: https://www.ctscorp.com/wp-content/uploads/296.pdf; Distributor: Digi-Key
ZD1-ZD7 = Zener Diode: 12V, 200mA, 500mW; Manufacturer: Vishay Semiconductor Diodes Division; Detailed Description: Zener Diode 12V 500mW  Through Hole DO-35; Digi-Key Part Number: BZX55C12-TAPGICT-ND; Manufacturer Part Number: BZX55C12-TAP; Datasheets: http://www.vishay.com/docs/85604/bzx55.pdf

## Nets that join several sheets
GND: Napajanje_1 (13 pins), Upravljacki deo (12 pins)
MOT+: Napajanje_1 (6 pins), Upravljacki deo (C10.1 C14.2 CE10.2 IC5.4)
MOT-: Napajanje_1 (6 pins), Upravljacki deo (C11.1 C15.2 CE11.2 IC6.4)
TK: Napajanje_1 (10 pins), Upravljacki deo (6 pins)
VCC: Napajanje_1 (C9.2 CE9.1 IC4.3), Upravljacki deo (17 pins)
VSS: Napajanje_1 (6 pins), Upravljacki deo (26 pins)
NetACS712_3: Napajanje_1 (Q1#1.3 Q3.2), Upravljacki deo (ACS712.3 ACS712.4)
NetBR_TIR_1: Napajanje_1 (BR_TIR.1), Upravljacki deo (ZD6.1)
NetC3_2: Napajanje_1 (C3.2 CE3.1 IC1.3), Upravljacki deo (ZD1.1)
NetC5_2: Napajanje_1 (C5.2 CE5.1 IC2.3), Upravljacki deo (ZD2.1)
NetC7_2: Napajanje_1 (C7.2 CE7.1 IC3.3), Upravljacki deo (ZD3.1 ZD4.1 ZD5.1)
NetC14_1: Napajanje_1 (Q1#1.1), Upravljacki deo (C14.1 R4.1)
NetC15_1: Napajanje_1 (Q2.1), Upravljacki deo (C15.1 R5.1)
NetC16_1: Napajanje_1 (Q3.1), Upravljacki deo (C16.1 R6.1)
NetC17_1: Napajanje_1 (Q4.1), Upravljacki deo (C17.1 R7.1)
NetC19_1: Napajanje_1 (Q5.1), Upravljacki deo (C19.1 R9.1)
NetC21_2: Napajanje_1 (T1.3), Upravljacki deo (C21.2 R10.1 R11.2 ZD7.2)
NetIC12_5: Napajanje_1 (R1.1 R2.2), Upravljacki deo (IC12.5)
NetP3_1: Napajanje_1 (Q2.3 Q4.2), Upravljacki deo (P3.1)